# Altium project 微四轴.PrjPcb
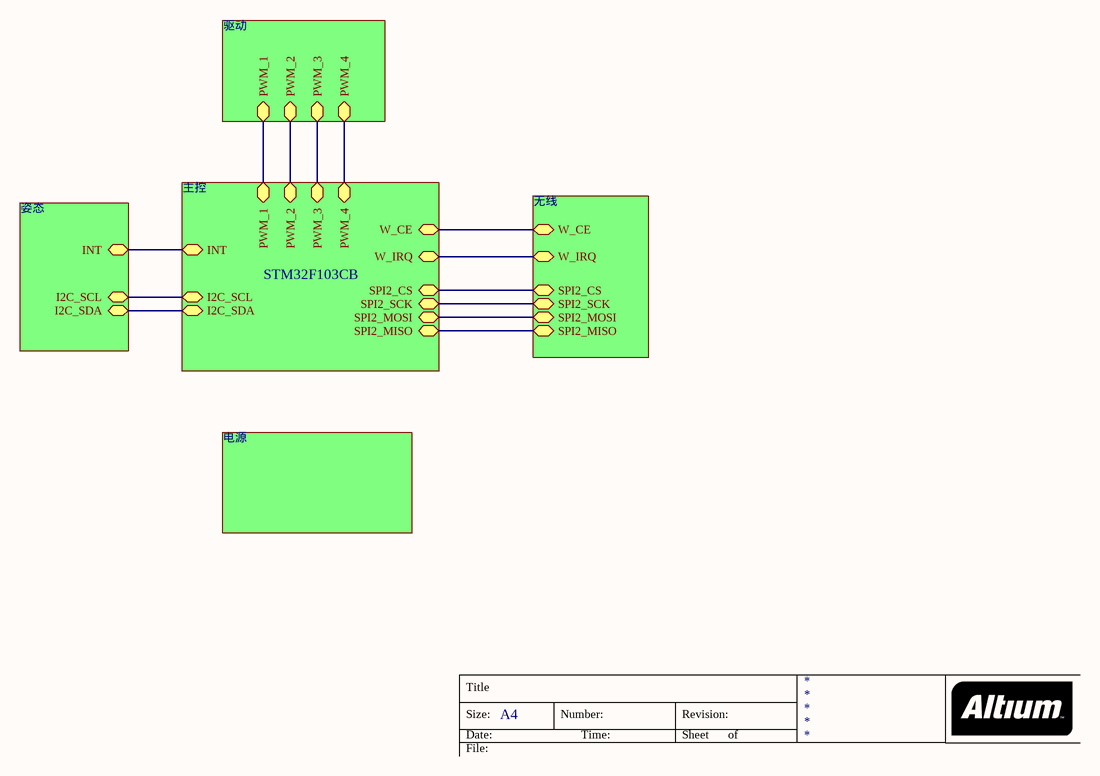
[diagram p0: 微四轴.SchDoc]
4 sheets, 77 parts. Net scope: hierarchical (ports join the sheet entries above them; power ports are global).
Board file: 天翊微四轴.PcbDoc
Sheets:
  微四轴.SchDoc
    电源 = 电源.SchDoc
    无线 = 无线.SchDoc
    姿态 = 姿态.SchDoc

## Sheet 微四轴.SchDoc: 微四轴
size A4; DocumentNumber: 1; Revision: 樊浩柏; SheetNumber: 1; SheetTotal: 6

### Sub-sheets
主控 = 主控 (file not in this document): INT, I2C_SCL, I2C_SDA, PWM_1, PWM_2, PWM_3, PWM_4, W_CE, W_IRQ, SPI2_CS, SPI2_SCK, SPI2_MOSI, SPI2_MISO
姿态 = 姿态: INT, I2C_SDA, I2C_SCL
无线 = 无线: W_CE, W_IRQ, SPI2_CS, SPI2_SCK, SPI2_MOSI, SPI2_MISO
电源 = 电源: no entries
驱动 = 驱动 (file not in this document): PWM_1, PWM_2, PWM_3, PWM_4

### Nets
I2C_SCL: sheet 姿态/I2C_SCL, sheet 主控/I2C_SCL
I2C_SDA: sheet 姿态/I2C_SDA, sheet 主控/I2C_SDA
NetU2_1: sheet 无线/W_CE, sheet 主控/W_CE
NetU2_2: sheet 无线/SPI2_CS, sheet 主控/SPI2_CS
NetU2_3: sheet 无线/SPI2_SCK, sheet 主控/SPI2_SCK
NetU2_4: sheet 无线/SPI2_MOSI, sheet 主控/SPI2_MOSI
NetU2_5: sheet 无线/SPI2_MISO, sheet 主控/SPI2_MISO
NetU2_6: sheet 无线/W_IRQ, sheet 主控/W_IRQ
NetU12_12: sheet 姿态/INT, sheet 主控/INT
(unnamed): sheet 驱动/PWM_1, sheet 主控/PWM_1
(unnamed): sheet 驱动/PWM_2, sheet 主控/PWM_2
(unnamed): sheet 驱动/PWM_3, sheet 主控/PWM_3
(unnamed): sheet 驱动/PWM_4, sheet 主控/PWM_4

### Notes on the sheet
- STM32F103CB
- Title
- Size:
- Date:
- A4
- Number:
- Time:
- Revision:
- Sheet
- of
- *
- File:

## Sheet 电源.SchDoc: 电源
size A4; DocumentNumber: 6; Revision: 樊浩柏; SheetNumber: 6; SheetTotal: 6
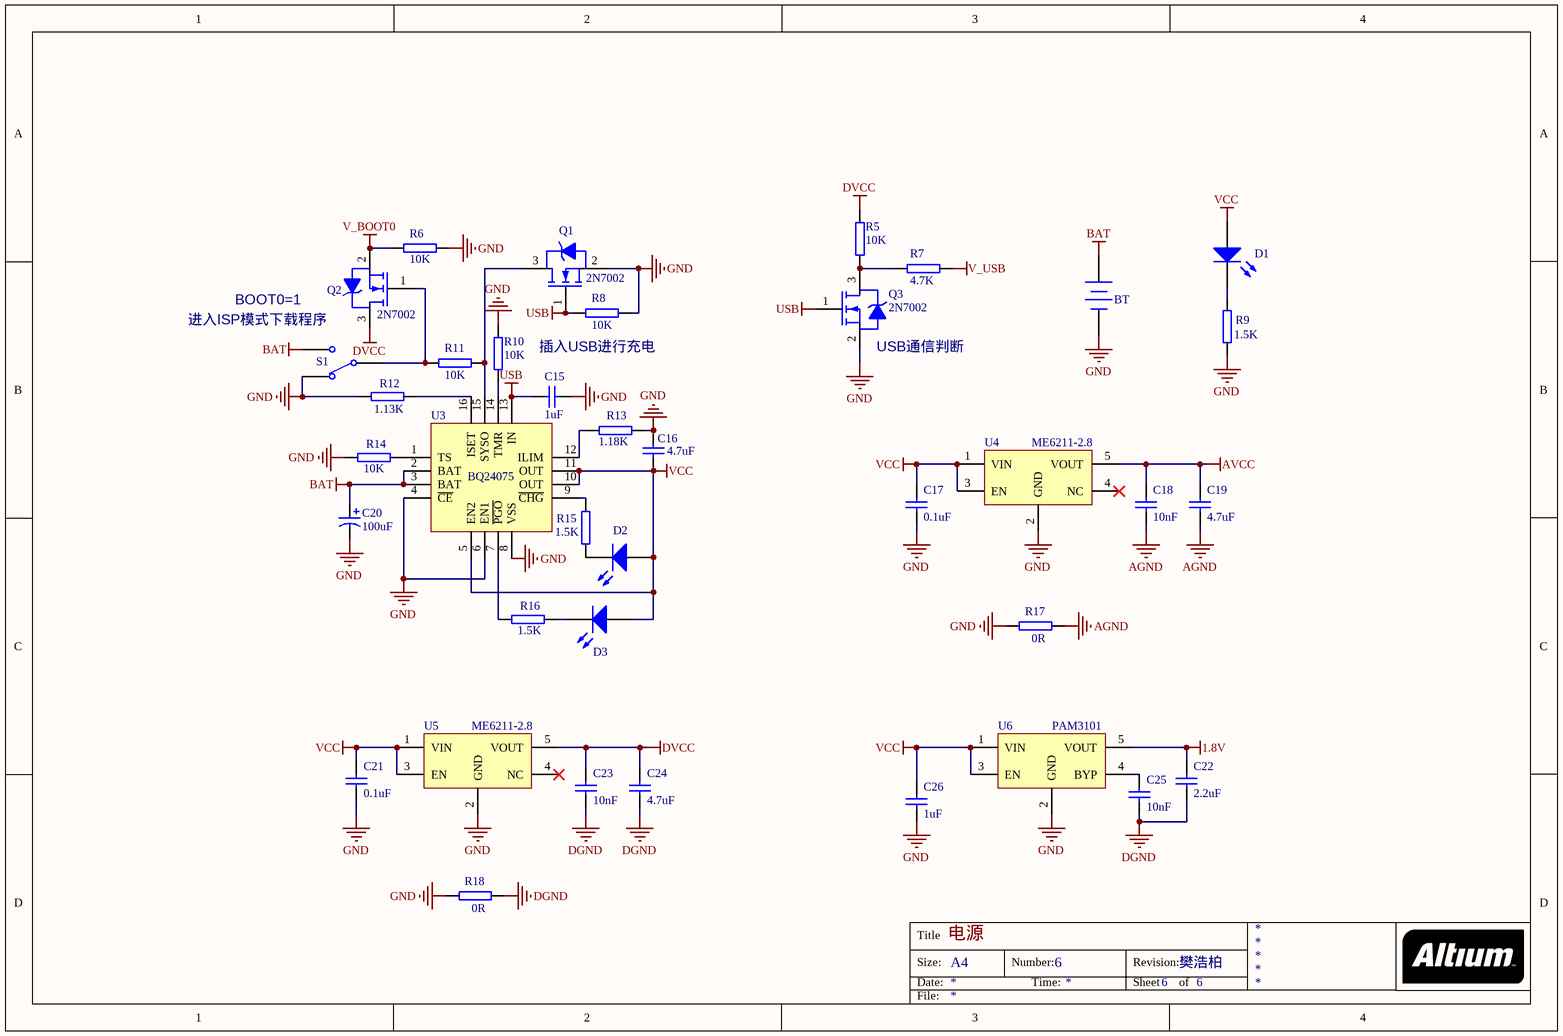
[diagram p1: 电源.SchDoc]

### Parts
BT  Battery  [Header-2.0-SMD]  (value not drawn)
C15  1uF  [CAP-0402]
C16  4.7uF  [CAP-0402]
C17  0.1uF  [CAP-0402]
C18  10nF  [CAP-0402]
C19  4.7uF  [CAP-0402]
C20  100uF  [CASE-A_3216-18]
C21  0.1uF  [CAP-0402]
C22  2.2uF  [CAP-0402]
C23  10nF  [CAP-0402]
C24  4.7uF  [CAP-0402]
C25  10nF  [CAP-0402]
C26  1uF  [CAP-0402]
D1  LED  [LED-BLU-0603]  (value not drawn)
D2  LED  [LED-BLU-0603]  (value not drawn)
D3  LED  [LED-RED-0603]  (value not drawn)
Q1  2N7002  [SOT-23-3-L]
Q2  2N7002  [SOT-23-3-L]
Q3  2N7002  [SOT-23-3-L]
R5  10K  [RES-0402]
R6  10K  [RES-0402]
R7  4.7K  [RES-0402]
R8  10K  [RES-0402]
R9  1.5K  [RES-0402]
R10  10K  [RES-0402]
R11  10K  [RES-0402]
R12  1.13K  [RES-0402]
R13  1.18K  [RES-0402]
R14  10K  [RES-0402]
R15  1.5K  [RES-0402]
R16  1.5K  [RES-0402]
R17  0R  [RES-0402]
R18  0R  [RES-0402]
S1  Key-3  [SW-MSK-12C02]  (value not drawn)
U3  BQ24075  [QFN-16-3x3MM]
U4  ME6211-2.8  [SOT-23-5]
U5  ME6211-2.8  [SOT-23-5]
U6  PAM3101  [SOT-23-5]

### Nets
1.8V: C22.1 U6.5(VOUT)
AGND: C18.2 C19.2 R17.1
AVCC: C18.1 C19.1 U4.5(VOUT)
BAT: BT.1(+) C20.A S1.1 U3.2(BAT) U3.3(BAT)
DGND: C22.2 C23.2 C24.2 C25.2 R18.1
DVCC: C23.1 C24.1 Q2.3(D) R5.1 U5.5(VOUT)
GND: BT.2(-) C15.2 C16.1 C17.2 C20.K C21.2 C26.2 Q1.2(S) Q3.2(S) R6.1 R8.1 R9.1 R10.2 R12.1 R13.1 R14.1 R17.2 R18.2 S1.3 U3.4(~{CE}) U3.6(EN1) U3.8(VSS) U4.2(GND) U5.2(GND) U6.2(GND)
USB: C15.1 Q1.1(G) Q3.1(G) R8.2 U3.13(IN)
V_BOOT0: Q2.2(S) R6.2
V_USB: R7.2
VCC: C16.2 C17.1 C21.1 C26.1 D1.A D2.A D3.A U3.5(EN2) U3.10(OUT) U3.11(OUT) U4.1(VIN) U4.3(EN) U5.1(VIN) U5.3(EN) U6.1(VIN) U6.3(EN)
NetC25_1: C25.1 U6.4(BYP)
NetD1_K: D1.K R9.2
NetD2_K: D2.K R15.1
NetD3_K: D3.K R16.2
NetQ1_3: Q1.3(D) R11.1 U3.15(SYSO)
NetQ2_1: Q2.1(G) R11.2 S1.2
NetQ3_3: Q3.3(D) R5.2 R7.1
NetR10_1: R10.1 U3.14(TMR)
NetR12_2: R12.2 U3.16(ISET)
NetR13_2: R13.2 U3.12(ILIM)
NetR14_2: R14.2 U3.1(TS)
NetR15_2: R15.2 U3.9(~{CHG})
NetR16_1: R16.1 U3.7(~{PGO})

Not connected (* = marked no-connect by the designer): U4 4(NC)*; U5 4(NC)*

### Notes on the sheet
- BOOT0=1
- 进入ISP模式下载程序
- 插入USB进行充电
- (near Q3) USB通信判断
- Title
- Size:
- Date:
- A4
- Number:
- Time:
- Revision:
- Sheet
- of
- File:

### Library data of the parts
C15-C19 C21-C26 = Cap
C20 = Cap-Pol_1
Q1-Q3 = N-MOS
R5-R18 = Res
U4 U5 = LDO: Published: 24-Mar-1999; LatestRevisionDate: 29-May-2009; LatestRevisionNote: IPC-7351 Footprint Added.; PackageReference: D2PAK; Publisher: Altium Limited; PackageDescription: 3-Pin Transistor Outline Package 2.54 mm Pitch, 15.1 mm Lead Span

## Sheet 无线.SchDoc: 无线
size A4; DocumentNumber: 2; Revision: 樊浩柏; SheetNumber: 2; SheetTotal: 6
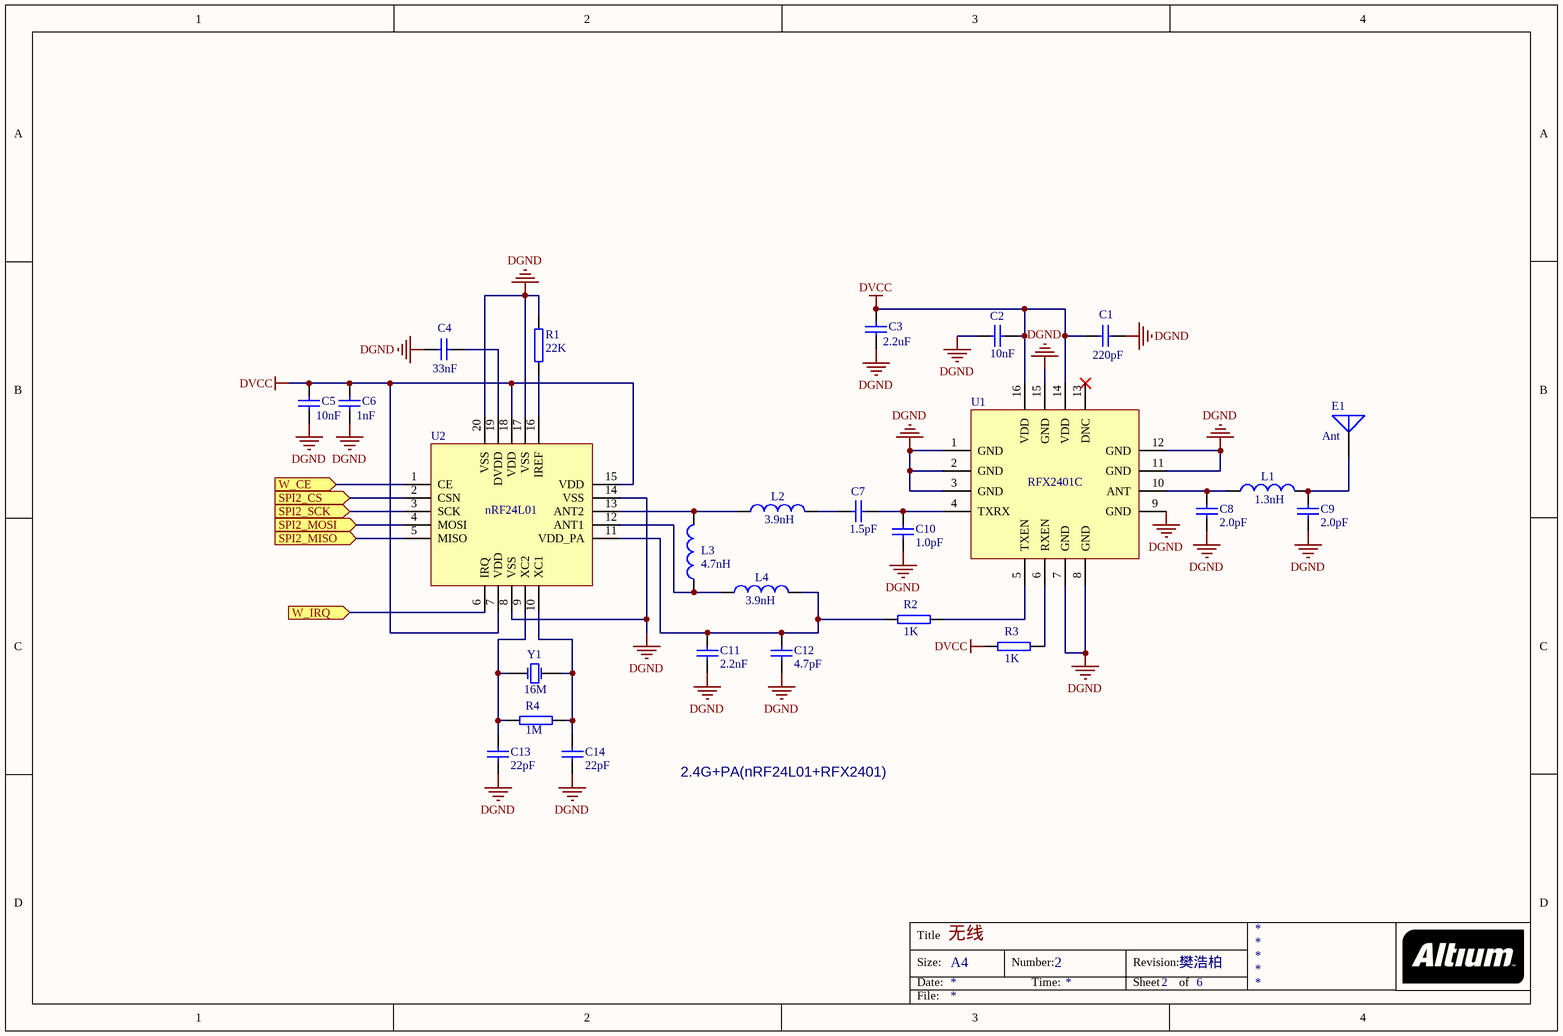
[diagram p2: 无线.SchDoc]

### Parts
C1  220pF  [CAP-0402]
C2  10nF  [CAP-0402]
C3  2.2uF  [CAP-0402]
C4  33nF  [CAP-0402]
C5  10nF  [CAP-0402]
C6  1nF  [CAP-0402]
C7  1.5pF  [CAP-0402]
C8  2.0pF  [CAP-0402]
C9  2.0pF  [CAP-0402]
C10  1.0pF  [CAP-0402]
C11  2.2nF  [CAP-0402]
C12  4.7pF  [CAP-0402]
C13  22pF  [CAP-0402]
C14  22pF  [CAP-0402]
E1  Ant  [ANT-SMD-5.0mm]
L1  1.3nH  [Chip Inductor-0402_100505]
L2  3.9nH  [Chip Inductor-0402_100505]
L3  4.7nH  [Chip Inductor-0402_100505]
L4  3.9nH  [Chip Inductor-0402_100505]
R1  22K  [RES-0402]
R2  1K  [RES-0402]
R3  1K  [RES-0402]
R4  1M  [RES-0402]
U1  RFX2401C  [QFN-16-3x3MM]
U2  nRF24L01  [QFN-20-4x4mm]
Y1  16M  [XTAL-OSC-3225]

### Ports
SPI2_CS (in), SPI2_MISO (in), SPI2_MOSI (in), SPI2_SCK (in), W_CE (in), W_IRQ

### Nets
DGND: C1.1 C2.2 C3.1 C4.2 C5.1 C6.1 C8.1 C9.1 C10.1 C11.1 C12.1 C13.1 C14.1 R1.2 U1.1(GND) U1.2(GND) U1.3(GND) U1.7(GND) U1.8(GND) U1.9(GND) U1.11(GND) U1.12(GND) U1.15(GND) U2.8(VSS) U2.14(VSS) U2.17(VSS) U2.20(VSS)
DVCC: C1.2 C2.1 C3.2 C5.2 C6.2 R3.2 U1.14(VDD) U1.16(VDD) U2.7(VDD) U2.15(VDD) U2.18(VDD)
NetC4_1: C4.1 U2.19(DVDD)
NetC7_1: C7.1 C10.2 U1.4(TXRX)
NetC7_2: C7.2 L2.2
NetC8_2: C8.2 L1.1 U1.10(ANT)
NetC9_2: C9.2 E1.1 L1.2
NetC11_2: C11.2 C12.2 L4.2 R2.1 U2.11(VDD_PA)
NetC13_2: C13.2 R4.2 U2.9(XC2) Y1.1(OSC1)
NetC14_2: C14.2 R4.1 U2.10(XC1) Y1.3(OSC2)
NetL2_1: L2.1 L3.2 U2.13(ANT2)
NetL3_1: L3.1 L4.1 U2.12(ANT1)
NetR1_1: R1.1 U2.16(IREF)
NetR2_2: R2.2 U1.5(TXEN)
NetR3_1: R3.1 U1.6(RXEN)
NetU2_1: U2.1(CE) ; port W_CE
NetU2_2: U2.2(CSN) ; port SPI2_CS
NetU2_3: U2.3(SCK) ; port SPI2_SCK
NetU2_4: U2.4(MOSI) ; port SPI2_MOSI
NetU2_5: U2.5(MISO) ; port SPI2_MISO
NetU2_6: U2.6(IRQ) ; port W_IRQ

Not connected (* = marked no-connect by the designer): U1 13(DNC)*

### Notes on the sheet
- 2.4G+PA(nRF24L01+RFX2401)
- Title
- Size:
- Date:
- A4
- Number:
- Time:
- Revision:
- Sheet
- of
- File:

### Library data of the parts
C1-C14 = Cap
L1-L4 = Inductor
R1-R4 = Res
Y1 = XTAL

## Sheet 姿态.SchDoc: 姿态
size A4; DocumentNumber: 3; Revision: 樊浩柏; SheetNumber: 3; SheetTotal: 6
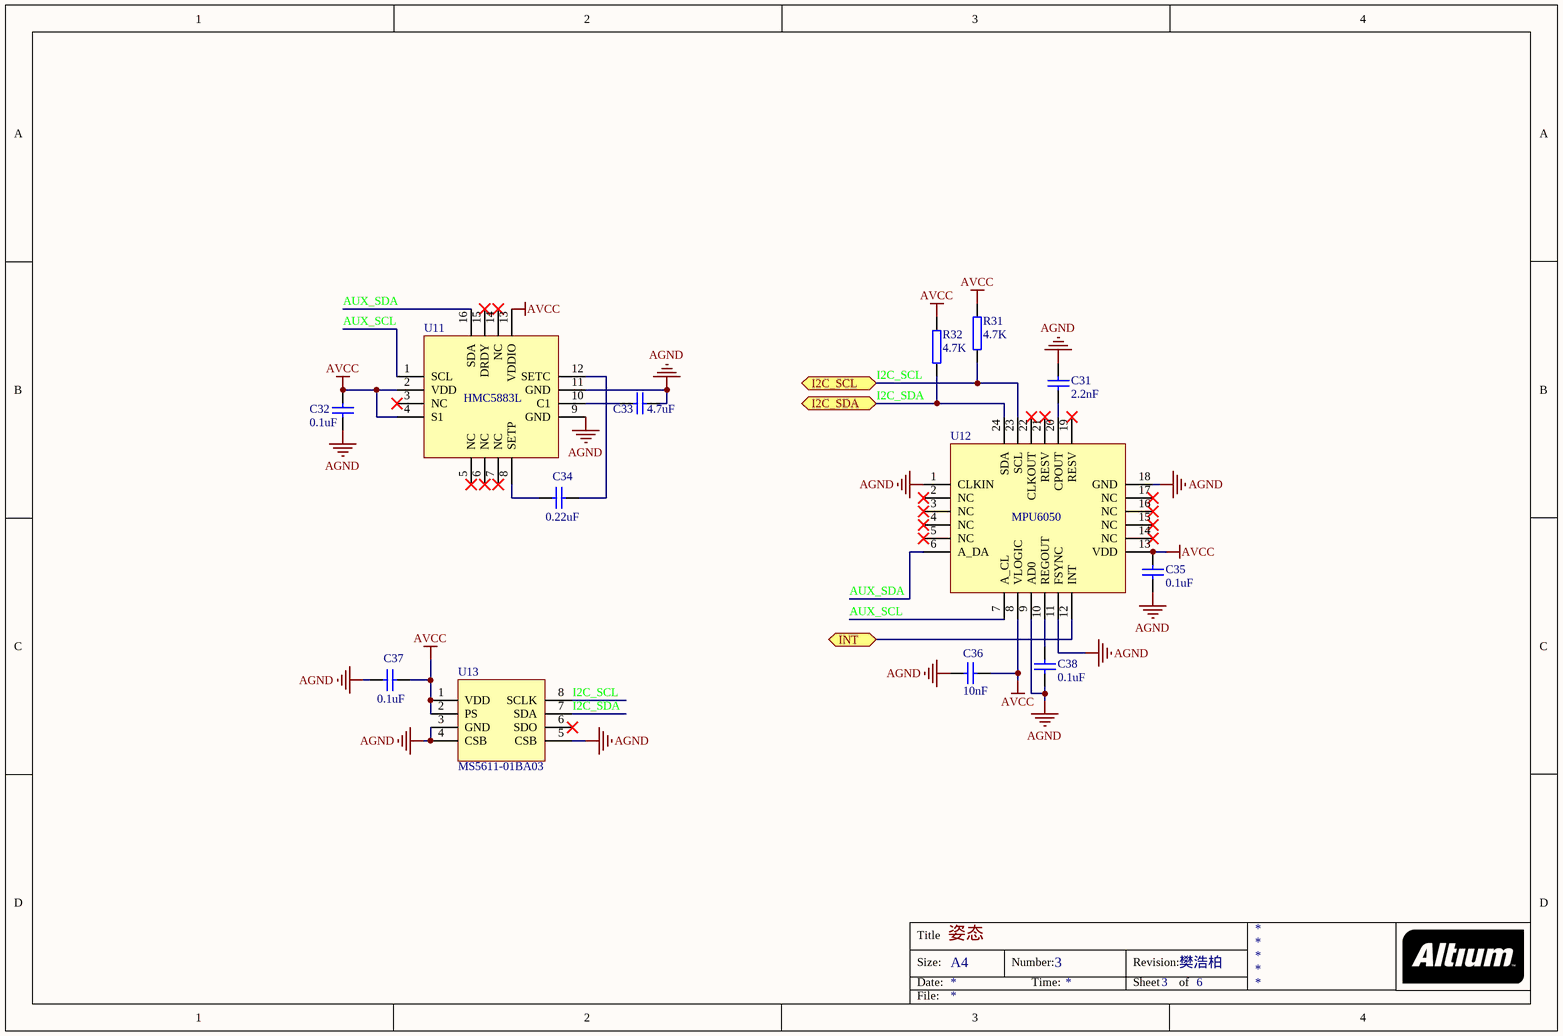
[diagram p3: 姿态.SchDoc]

### Parts
C31  2.2nF  [CAP-0402]
C32  0.1uF  [CAP-0402]
C33  4.7uF  [CAP-0402]
C34  0.22uF  [CAP-0402]
C35  0.1uF  [CAP-0402]
C36  10nF  [CAP-0402]
C37  0.1uF  [CAP-0402]
C38  0.1uF  [CAP-0402]
R31  4.7K  [RES-0402]
R32  4.7K  [RES-0402]
U11  HMC5883L  [QFN-16-3x3MM]
U12  MPU6050  [QFN-24-4x4mm]
U13  MS5611-01BA03  [LGA-8]

### Ports
I2C_SCL, I2C_SDA, INT

### Nets
AGND: C31.2 C32.1 C33.1 C35.1 C36.1 C37.2 C38.1 U11.9(GND) U11.11(GND) U12.1(CLKIN) U12.9(AD0) U12.11(FSYNC) U12.18(GND) U13.3(GND) U13.4(CSB) U13.5(CSB)
AVCC: C32.2 C35.2 C36.2 C37.1 R31.1 R32.1 U11.2(VDD) U11.4(S1) U11.13(VDDIO) U12.8(VLOGIC) U12.13(VDD) U13.1(VDD) U13.2(PS)
AUX_SCL: U11.1(SCL) U12.7(A_CL)
AUX_SDA: U11.16(SDA) U12.6(A_DA)
I2C_SCL: R31.2 U12.23(SCL) U13.8(SCLK) ; port I2C_SCL
I2C_SDA: R32.2 U12.24(SDA) U13.7(SDA) ; port I2C_SDA
NetC31_1: C31.1 U12.20(CPOUT)
NetC33_2: C33.2 U11.10(C1)
NetC34_1: C34.1 U11.12(SETC)
NetC34_2: C34.2 U11.8(SETP)
NetC38_2: C38.2 U12.10(REGOUT)
NetU12_12: U12.12(INT) ; port INT

Not connected (* = marked no-connect by the designer): U11 3(NC)* 5(NC)* 6(NC)* 7(NC)* 14(NC)* 15(DRDY)*; U12 2(NC)* 3(NC)* 4(NC)* 5(NC)* 14(NC)* 15(NC)* 16(NC)* 17(NC)* 19(RESV)* 21(RESV)* 22(CLKOUT)*; U13 6(SDO)*

### Notes on the sheet
- Title
- Size:
- Date:
- A4
- Number:
- Time:
- Revision:
- Sheet
- of
- File:

### Library data of the parts
C31-C38 = Cap
R31 R32 = Res
U13 = MS5611

## Nets that join several sheets
AGND: 电源 (C18.2 C19.2 R17.1), 姿态 (16 pins)
AVCC: 电源 (C18.1 C19.1 U4.5), 姿态 (13 pins)
DGND: 电源 (5 pins), 无线 (27 pins)
DVCC: 电源 (5 pins), 无线 (11 pins)